# EAGLE design EC-TDS-PPM1_2 (EAGLE 7.5.0)
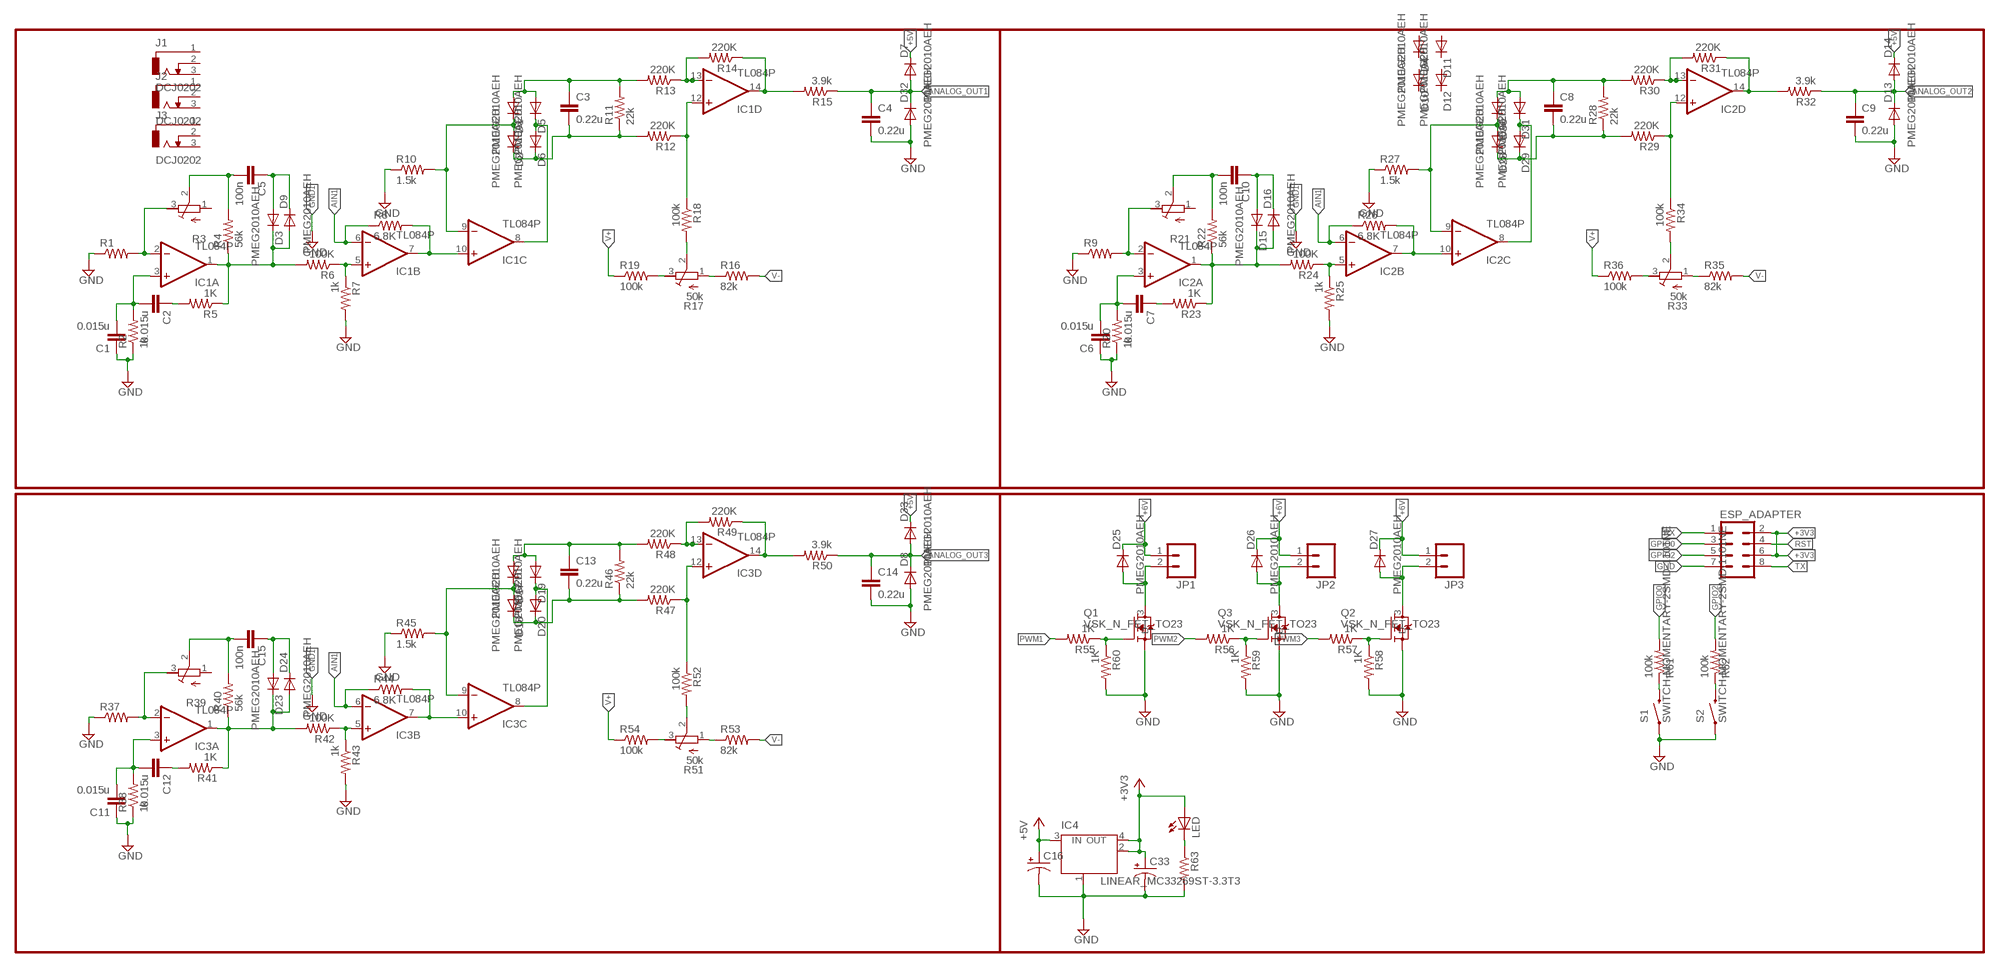
[diagram p0: schematic, sheet 1, part 1 of 2]
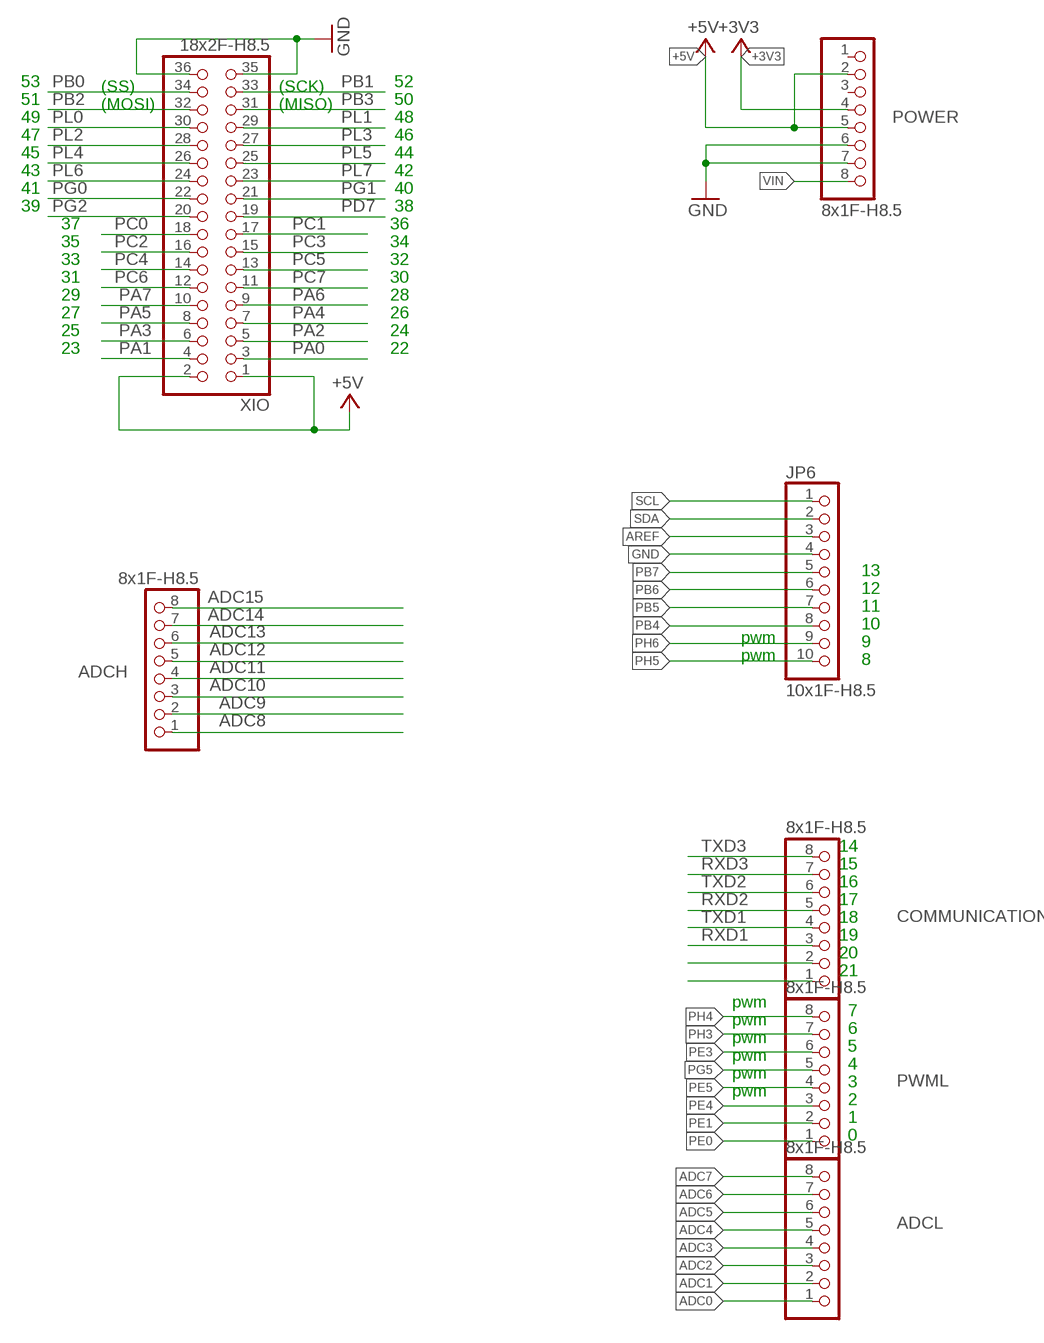
[diagram p1: schematic, sheet 1, part 2 of 2]

## Parts
ADCH  8x1F-H8.5  PINHD-1X8  [1X08]
ADCL  8x1F-H8.5  PINHD-1X8  [1X08]
C1  0.015u  C-EUC0603  [C0603]
C2  0.015u  C-EUC0603  [C0603]
C3  0.22u  C-EUC0603  [C0603]
C4  0.22u  C-EUC0603  [C0603]
C5  100n  C-EUC0603  [C0603]
C6  0.015u  C-EUC0603  [C0603]
C7  0.015u  C-EUC0603  [C0603]
C8  0.22u  C-EUC0603  [C0603]
C9  0.22u  C-EUC0603  [C0603]
C10  100n  C-EUC0603  [C0603]
C11  0.015u  C-EUC0603  [C0603]
C12  0.015u  C-EUC0603  [C0603]
C13  0.22u  C-EUC0603  [C0603]
C14  0.22u  C-EUC0603  [C0603]
C15  100n  C-EUC0603  [C0603]
C16  CPOL-USSMCC  [SMC_C]
C33  CPOL-USSMCC  [SMC_C]
COMMUNICATION  8x1F-H8.5  PINHD-1X8  [1X08]
D1  PMEG2010AEH  DIOD_SOT123F  [SOT123F]
D2  PMEG2010AEH  DIOD_SOT123F  [SOT123F]
D3  PMEG2010AEH  DIOD_SOT123F  [SOT123F]
D4  PMEG2010AEH  DIOD_SOT123F  [SOT123F]
D5  PMEG2010AEH  DIOD_SOT123F  [SOT123F]
D6  PMEG2010AEH  DIOD_SOT123F  [SOT123F]
D7  PMEG2010AEH  DIOD_SOT123F  [SOT123F]
D8  PMEG2010AEH  DIOD_SOT123F  [SOT123F]
D9  PMEG2010AEH  DIOD_SOT123F  [SOT123F]
D10  PMEG2010AEH  DIOD_SOT123F  [SOT123F]
D11  PMEG2010AEH  DIOD_SOT123F  [SOT123F]
D12  PMEG2010AEH  DIOD_SOT123F  [SOT123F]
D13  PMEG2010AEH  DIOD_SOT123F  [SOT123F]
D14  PMEG2010AEH  DIOD_SOT123F  [SOT123F]
D15  PMEG2010AEH  DIOD_SOT123F  [SOT123F]
D16  PMEG2010AEH  DIOD_SOT123F  [SOT123F]
D17  PMEG2010AEH  DIOD_SOT123F  [SOT123F]
D18  PMEG2010AEH  DIOD_SOT123F  [SOT123F]
D19  PMEG2010AEH  DIOD_SOT123F  [SOT123F]
D20  PMEG2010AEH  DIOD_SOT123F  [SOT123F]
D23  PMEG2010AEH  DIOD_SOT123F  [SOT123F]
D24  PMEG2010AEH  DIOD_SOT123F  [SOT123F]
D25  PMEG2010AEH  DIOD_SOT123F  [SOT123F]
D26  PMEG2010AEH  DIOD_SOT123F  [SOT123F]
D27  PMEG2010AEH  DIOD_SOT123F  [SOT123F]
D28  PMEG2010AEH  DIOD_SOT123F  [SOT123F]
D29  PMEG2010AEH  DIOD_SOT123F  [SOT123F]
D30  PMEG2010AEH  DIOD_SOT123F  [SOT123F]
D31  PMEG2010AEH  DIOD_SOT123F  [SOT123F]
D32  PMEG2010AEH  DIOD_SOT123F  [SOT123F]
D33  PMEG2010AEH  DIOD_SOT123F  [SOT123F]
ESP_ADAPTER  M04X2  [2X4]
IC1  TL084P  [DIL14]
IC2  TL084P  [DIL14]
IC3  TL084P  [DIL14]
IC4  LINEAR_MC33269ST-3.3T3  [LINEAR_SOT223]
J1  DCJ0202  [DCJ0202]
J2  DCJ0202  [DCJ0202]
J3  DCJ0202  [DCJ0202]
JP1  M02PTH  [1X02]
JP2  M02PTH  [1X02]
JP3  M02PTH  [1X02]
JP6  10x1F-H8.5  PINHD-1X10_ARD  [1X10]
LED  SPARKFUN_LED0603  [SPARKFUN_LED-0603]
POWER  8x1F-H8.5  PINHD-1X8  [1X08]
PWML  8x1F-H8.5  PINHD-1X8  [1X08]
Q1  VSK_N_FET_TO23  [SOT23]
Q2  VSK_N_FET_TO23  [SOT23]
Q3  VSK_N_FET_TO23  [SOT23]
R1  R-US_R0603  [R0603]
R2  1k  R-US_R0603  [R0603]
R3  R-TRIMM64W  [RTRIM64W]
R4  56k  R-US_R0603  [R0603]
R5  1K  R-US_R0603  [R0603]
R6  100K  R-US_R0603  [R0603]
R7  1k  R-US_R0603  [R0603]
R8  6.8K  R-US_R0603  [R0603]
R9  R-US_R0603  [R0603]
R10  1.5k  R-US_R0603  [R0603]
R11  22k  R-US_R0603  [R0603]
R12  220K  R-US_R0603  [R0603]
R13  220K  R-US_R0603  [R0603]
R14  220K  R-US_R0603  [R0603]
R15  3.9k  R-US_R0603  [R0603]
R16  82k  R-US_R0603  [R0603]
R17  50k  R-TRIMM64W  [RTRIM64W]
R18  100k  R-US_R0603  [R0603]
R19  100k  R-US_R0603  [R0603]
R20  1k  R-US_R0603  [R0603]
R21  R-TRIMM64W  [RTRIM64W]
R22  56k  R-US_R0603  [R0603]
R23  1K  R-US_R0603  [R0603]
R24  100K  R-US_R0603  [R0603]
R25  1k  R-US_R0603  [R0603]
R26  6.8K  R-US_R0603  [R0603]
R27  1.5k  R-US_R0603  [R0603]
R28  22k  R-US_R0603  [R0603]
R29  220K  R-US_R0603  [R0603]
R30  220K  R-US_R0603  [R0603]
R31  220K  R-US_R0603  [R0603]
R32  3.9k  R-US_R0603  [R0603]
R33  50k  R-TRIMM64W  [RTRIM64W]
R34  100k  R-US_R0603  [R0603]
R35  82k  R-US_R0603  [R0603]
R36  100k  R-US_R0603  [R0603]
R37  R-US_R0603  [R0603]
R38  1k  R-US_R0603  [R0603]
R39  R-TRIMM64W  [RTRIM64W]
R40  56k  R-US_R0603  [R0603]
R41  1K  R-US_R0603  [R0603]
R42  100K  R-US_R0603  [R0603]
R43  1k  R-US_R0603  [R0603]
R44  6.8K  R-US_R0603  [R0603]
R45  1.5k  R-US_R0603  [R0603]
R46  22k  R-US_R0603  [R0603]
R47  220K  R-US_R0603  [R0603]
R48  220K  R-US_R0603  [R0603]
R49  220K  R-US_R0603  [R0603]
R50  3.9k  R-US_R0603  [R0603]
R51  50k  R-TRIMM64W  [RTRIM64W]
R52  100k  R-US_R0603  [R0603]
R53  82k  R-US_R0603  [R0603]
R54  100k  R-US_R0603  [R0603]
R55  1K  R-US_R0603  [R0603]
R56  1K  R-US_R0603  [R0603]
R57  1K  R-US_R0603  [R0603]
R58  1K  R-US_R0603  [R0603]
R59  1K  R-US_R0603  [R0603]
R60  1K  R-US_R0603  [R0603]
R61  100k  R-US_R0603  [R0603]
R62  100k  R-US_R0603  [R0603]
R63  SPARKFUN_RESISTOR0603-RES  [SPARKFUN_0603-RES]
S1  SWITCH-MOMENTARY-2SMD-1101NE  [TACTILE-SWITCH-1101NE]
S2  SWITCH-MOMENTARY-2SMD-1101NE  [TACTILE-SWITCH-1101NE]
XIO  18x2F-H8.5  PINHD-2X18  [2X18]

## Nets
+3V3: C33.+ ESP_ADAPTER.2 ESP_ADAPTER.6 IC4.2(OUT) IC4.4(OUT) LED.A POWER.4
+5V: C16.+ D7.C D14.C D33.C IC4.3(IN) POWER.2 POWER.5 XIO.1 XIO.2
+6V: D25.C D26.C D27.C JP1.1 JP2.1 JP3.1
ADC0: ADCL.1
ADC1: ADCL.2
ADC2: ADCL.3
ADC3: ADCL.4
ADC4: ADCL.5
ADC5: ADCL.6
ADC6: ADCL.7
ADC7: ADCL.8
ADC8: ADCH.1
ADC9: ADCH.2
ADC10: ADCH.3
ADC11: ADCH.4
ADC12: ADCH.5
ADC13: ADCH.6
ADC14: ADCH.7
ADC15: ADCH.8
AIN1: IC1.6(B:-IN) IC2.6(B:-IN) IC3.6(B:-IN) R8.1 R26.1 R44.1
ANALOG_OUT1: C4.1 D7.A D32.C R15.1
ANALOG_OUT2: C9.1 D13.C D14.A R32.1
ANALOG_OUT3: C14.1 D8.C D33.A R50.1
AREF: JP6.3
GND: ESP_ADAPTER.7 JP6.4 POWER.6 POWER.7 XIO.35 XIO.36
GND1: C1.1 C4.2 C6.1 C9.2 C11.1 C14.2 C16.- C33.- D8.A D13.A D32.A IC4.1(GND/ADJ) Q1.2(S) Q2.2(S) Q3.2(S) R1.1 R2.1 R7.2 R9.1 R10.1 R20.1 R25.2 R27.1 R37.1 R38.1 R43.2 R45.1 R58.2 R59.2 R60.2 R63.2 S1.1 S2.1 ; supply symbol labelled GND
GPIO0: ESP_ADAPTER.3 R61.2
GPIO2: ESP_ADAPTER.5 R62.2
N$1: IC1.2(A:-IN) R1.2 R3.3(E)
N$2: C2.1 R5.2
N$3: C1.2 C2.2 IC1.3(A:+IN) R2.2
N$4: IC1.5(B:+IN) R6.1 R7.1
N$5: C5.2 R3.2(S) R4.2
N$6: R16.1 R17.1(A)
N$7: D3.C D9.A IC1.1(A:OUT) R4.1 R5.1 R6.2
N$8: C5.1 D3.A D9.C
N$9: IC1.7(B:OUT) IC1.10(C:+IN) R8.2
N$10: R17.3(E) R19.2
N$11: IC1.13(D:-IN) R13.1 R14.2
N$12: C3.1 D1.A D5.A R11.2 R13.2
N$13: D1.C D2.A IC1.9(C:-IN) R10.2
N$14: C3.2 D2.C D6.C R11.1 R12.2
N$15: D5.C D6.A IC1.8(C:OUT)
N$16: IC1.12(D:+IN) R12.1 R18.1
N$17: IC1.14(D:OUT) R14.1 R15.2
N$18: R17.2(S) R18.2
N$19: IC2.2(A:-IN) R9.2 R21.3(E)
N$20: C6.2 C7.2 IC2.3(A:+IN) R20.2
N$21: C10.2 R21.2(S) R22.2
N$22: D15.C D16.A IC2.1(A:OUT) R22.1 R23.1 R24.2
N$23: C7.1 R23.2
N$24: IC2.5(B:+IN) R24.1 R25.1
N$25: IC2.7(B:OUT) IC2.10(C:+IN) R26.2
N$26: C8.1 D30.A D31.A R28.2 R30.2
N$27: D28.A D30.C IC2.9(C:-IN) R27.2
N$28: C8.2 D28.C D29.C R28.1 R29.2
N$29: D29.A D31.C IC2.8(C:OUT)
N$30: IC2.13(D:-IN) R30.1 R31.2
N$31: IC2.12(D:+IN) R29.1 R34.1
N$32: IC2.14(D:OUT) R31.1 R32.2
N$33: C10.1 D15.A D16.C
N$34: R33.1(A) R35.1
N$35: R33.3(E) R36.2
N$36: R33.2(S) R34.2
N$37: IC3.2(A:-IN) R37.2 R39.3(E)
N$38: C11.2 C12.2 IC3.3(A:+IN) R38.2
N$39: C15.2 R39.2(S) R40.2
N$40: D23.C D24.A IC3.1(A:OUT) R40.1 R41.1 R42.2
N$41: C12.1 R41.2
N$42: IC3.5(B:+IN) R42.1 R43.1
N$43: IC3.7(B:OUT) IC3.10(C:+IN) R44.2
N$44: C13.1 D17.A D19.A R46.2 R48.2
N$45: D17.C D18.A IC3.9(C:-IN) R45.2
N$46: C13.2 D18.C D20.C R46.1 R47.2
N$47: D19.C D20.A IC3.8(C:OUT)
N$48: IC3.13(D:-IN) R48.1 R49.2
N$49: IC3.12(D:+IN) R47.1 R52.1
N$50: IC3.14(D:OUT) R49.1 R50.2
N$51: C15.1 D23.A D24.C
N$52: R51.1(A) R53.1
N$53: R51.3(E) R54.2
N$54: R51.2(S) R52.2
N$55: D26.A JP2.2 Q3.3(D)
N$56: D27.A JP3.2 Q2.3(D)
N$57: D25.A JP1.2 Q1.3(D)
N$58: Q2.1(G) R57.1 R58.1
N$59: Q3.1(G) R56.1 R59.1
N$61: Q1.1(G) R55.1 R60.1
N$62: R61.1 S1.2
N$63: R62.1 S2.2
N$64: LED.C R63.1
PA0: XIO.3
PA1: XIO.4
PA2: XIO.5
PA3: XIO.6
PA4: XIO.7
PA5: XIO.8
PA6: XIO.9
PA7: XIO.10
PB0: XIO.34
PB1: XIO.33
PB2: XIO.32
PB3: XIO.31
PB4: JP6.8
PB5: JP6.7
PB6: JP6.6
PB7: JP6.5
PC0: XIO.18
PC1: XIO.17
PC2: XIO.16
PC3: XIO.15
PC4: XIO.14
PC5: XIO.13
PC6: XIO.12
PC7: XIO.11
PD7: XIO.19
PE0: PWML.1
PE1: PWML.2
PE3: PWML.6
PE4: PWML.3
PE5: PWML.4
PG0: XIO.22
PG1: XIO.21
PG2: XIO.20
PG5: PWML.5
PH3: PWML.7
PH4: PWML.8
PH5: JP6.10
PH6: JP6.9
PL0: XIO.30
PL1: XIO.29
PL2: XIO.28
PL3: XIO.27
PL4: XIO.26
PL5: XIO.25
PL6: XIO.24
PL7: XIO.23
PWM1: R55.2
PWM2: R56.2
PWM3: R57.2
RST: ESP_ADAPTER.4
RX: ESP_ADAPTER.1
RXD1: COMMUNICATION.3
RXD2: COMMUNICATION.5
RXD3: COMMUNICATION.7
SCL: COMMUNICATION.1 JP6.1
SDA: COMMUNICATION.2 JP6.2
TX: ESP_ADAPTER.8
TXD1: COMMUNICATION.4
TXD2: COMMUNICATION.6
TXD3: COMMUNICATION.8
V+: R19.1 R36.1 R54.1
V-: R16.2 R35.2 R53.2
VIN [power]: POWER.8
Unconnected: D4.A D4.C D10.A D10.C D11.A D11.C D12.A D12.C J1.1 J1.2 J1.3 J2.1 J2.2 J2.3 J3.1 J3.2 J3.3 POWER.1 POWER.3 R3.1(A) R21.1(A) R39.1(A)

## Notes on the sheet
- 53 | (SS) | (SCK) | 52
- 51 | (MOSI) | (MISO) | 50
- 49 | 48
- 47 | 46
- 45 | 44
- 43 | 42
- 41 | 40
- 39 | 38
- 37 | 36
- 35 | 34
- 33 | 32
- 31 | 30
- 29 | 28
- 27 | 26
- 25 | 24
- 23 | 22
- 13
- 12
- 11
- 10
- pwm | 9
- pwm | 8
- 14
- 15
- 16
- 17
- 18
- 19
- 20
- 21
- pwm
- 7
- pwm
- 6
- pwm
- 5
- pwm
- 4
- pwm
- 3
- pwm
- 2
- 1
- 0

## Power pins joined to a net without a drawn wire
V+: IC1.4(P:V+) IC2.4(P:V+) IC3.4(P:V+)
V-: IC1.11(P:V-) IC2.11(P:V-) IC3.11(P:V-)

## Library data of the parts
ADCH ADCL COMMUNICATION POWER PWML = SmartPrj:PINHD-1X8: PIN HEADER
C1-C15 = resistor:C-EU: CAPACITOR, European symbol
C16 C33 = rcl:CPOL-US: POLARIZED CAPACITOR, American symbol
D1-D20 D23-D33 = Enleka_Diode:DIOD_SOT123F; PARTNO: PMEG2010AEH,115
ESP_ADAPTER = SparkFun-Connectors:M04X2: .1" header, two rows of four.
IC1-IC3 = linear:TL084: OP AMP
IC4 = Robotech_Other:LINEAR_MC33269ST*: Adjustable Output Low Dropout Voltage Regulator 800 mA Source: http://www.onsemi.com/pub/Collateral/MC33269-D.PDF
J1-J3 = con-jack:DCJ0202: DC POWER JACK Source: DCJ0202.pdf; OC_FARNELL: unknown; OC_NEWARK: unknown
JP1-JP3 = SparkFun-Connectors:M02: Standard 2-pin 0.1" header. Use with - straight break away headers ( PRT-00116) - right angle break away headers (PRT-00553) - swiss pins (PRT-00743) - machine pins (PRT-00117) - female headers (PRT-00115) Molex polarized connector foot print use with: PRT-08233 with associated crimp pins and housings. 2.54_SCREWTERM for use with PRT-10571. 3.5mm Screw Terminal footprints for PRT-08084 5mm Screw Terminal footprints for use with PRT-08432
JP6 = SmartPrj:PINHD-1X10_ARD: PIN HEADER
LED = Robotech RLC of Chung:SPARKFUN_LED: LEDs Standard schematic elements and footprints for 5mm, 3mm, 1206, and 0603 sized LEDs. 5mm - Spark Fun Electronics SKU : COM-00529 (and others)
Q1-Q3 = transistor-fet:VSK_N_FET_TO23
R1 R2 R4-R16 R18-R20 R22-R32 R34-R38 R40-R50 R52-R62 = resistor:R-US_: RESISTOR, American symbol
R3 R17 R21 R33 R39 R51 = resistor:R-TRIMM: Trimm resistor
R63 = Robotech_RCL:SPARKFUN_RESISTOR: Resistor Basic schematic elements and footprints for 0603, 1206, and PTH resistors.
S1 S2 = SparkFun-Electromechanical:SWITCH-MOMENTARY-2: Various NO switches- pushbuttons, reed, etc; PROD_ID: SWCH-00815
XIO = SmartPrj:PINHD-2X18: PIN HEADER

## Net classes
0 default: width 0.203 mm, drill 0.406 mm, clearance 0.203 mm
1 power: width 0.61 mm, drill 0.406 mm, clearance 0.203 mm
2 gnd: width 0.305 mm, drill 0.406 mm, clearance 0.203 mm
3 power usb: width 0.508 mm, drill 0.406 mm, clearance 0.203 mm

## Board
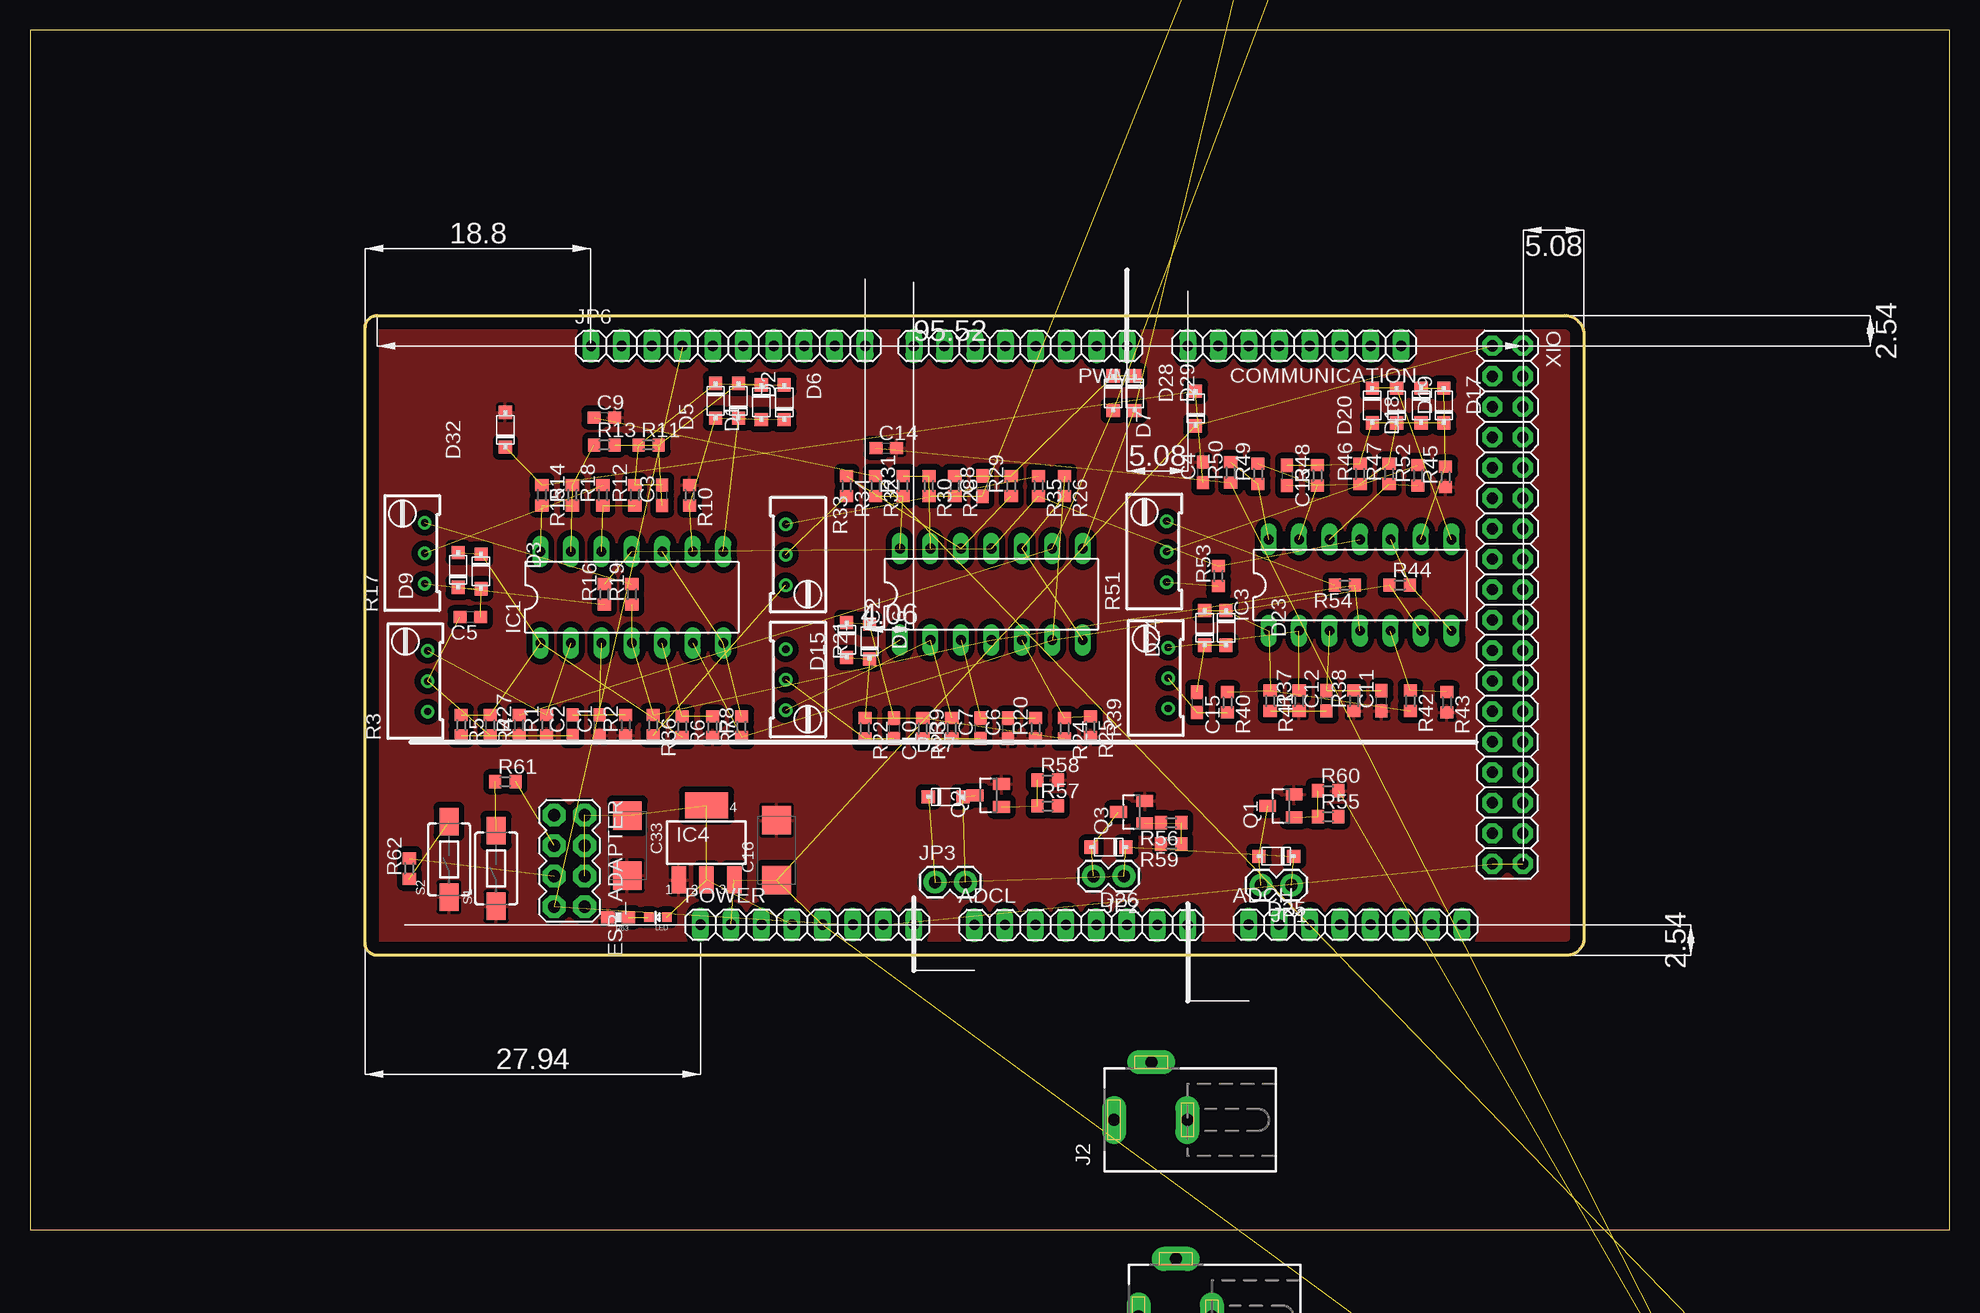
[diagram p2: board, top side]
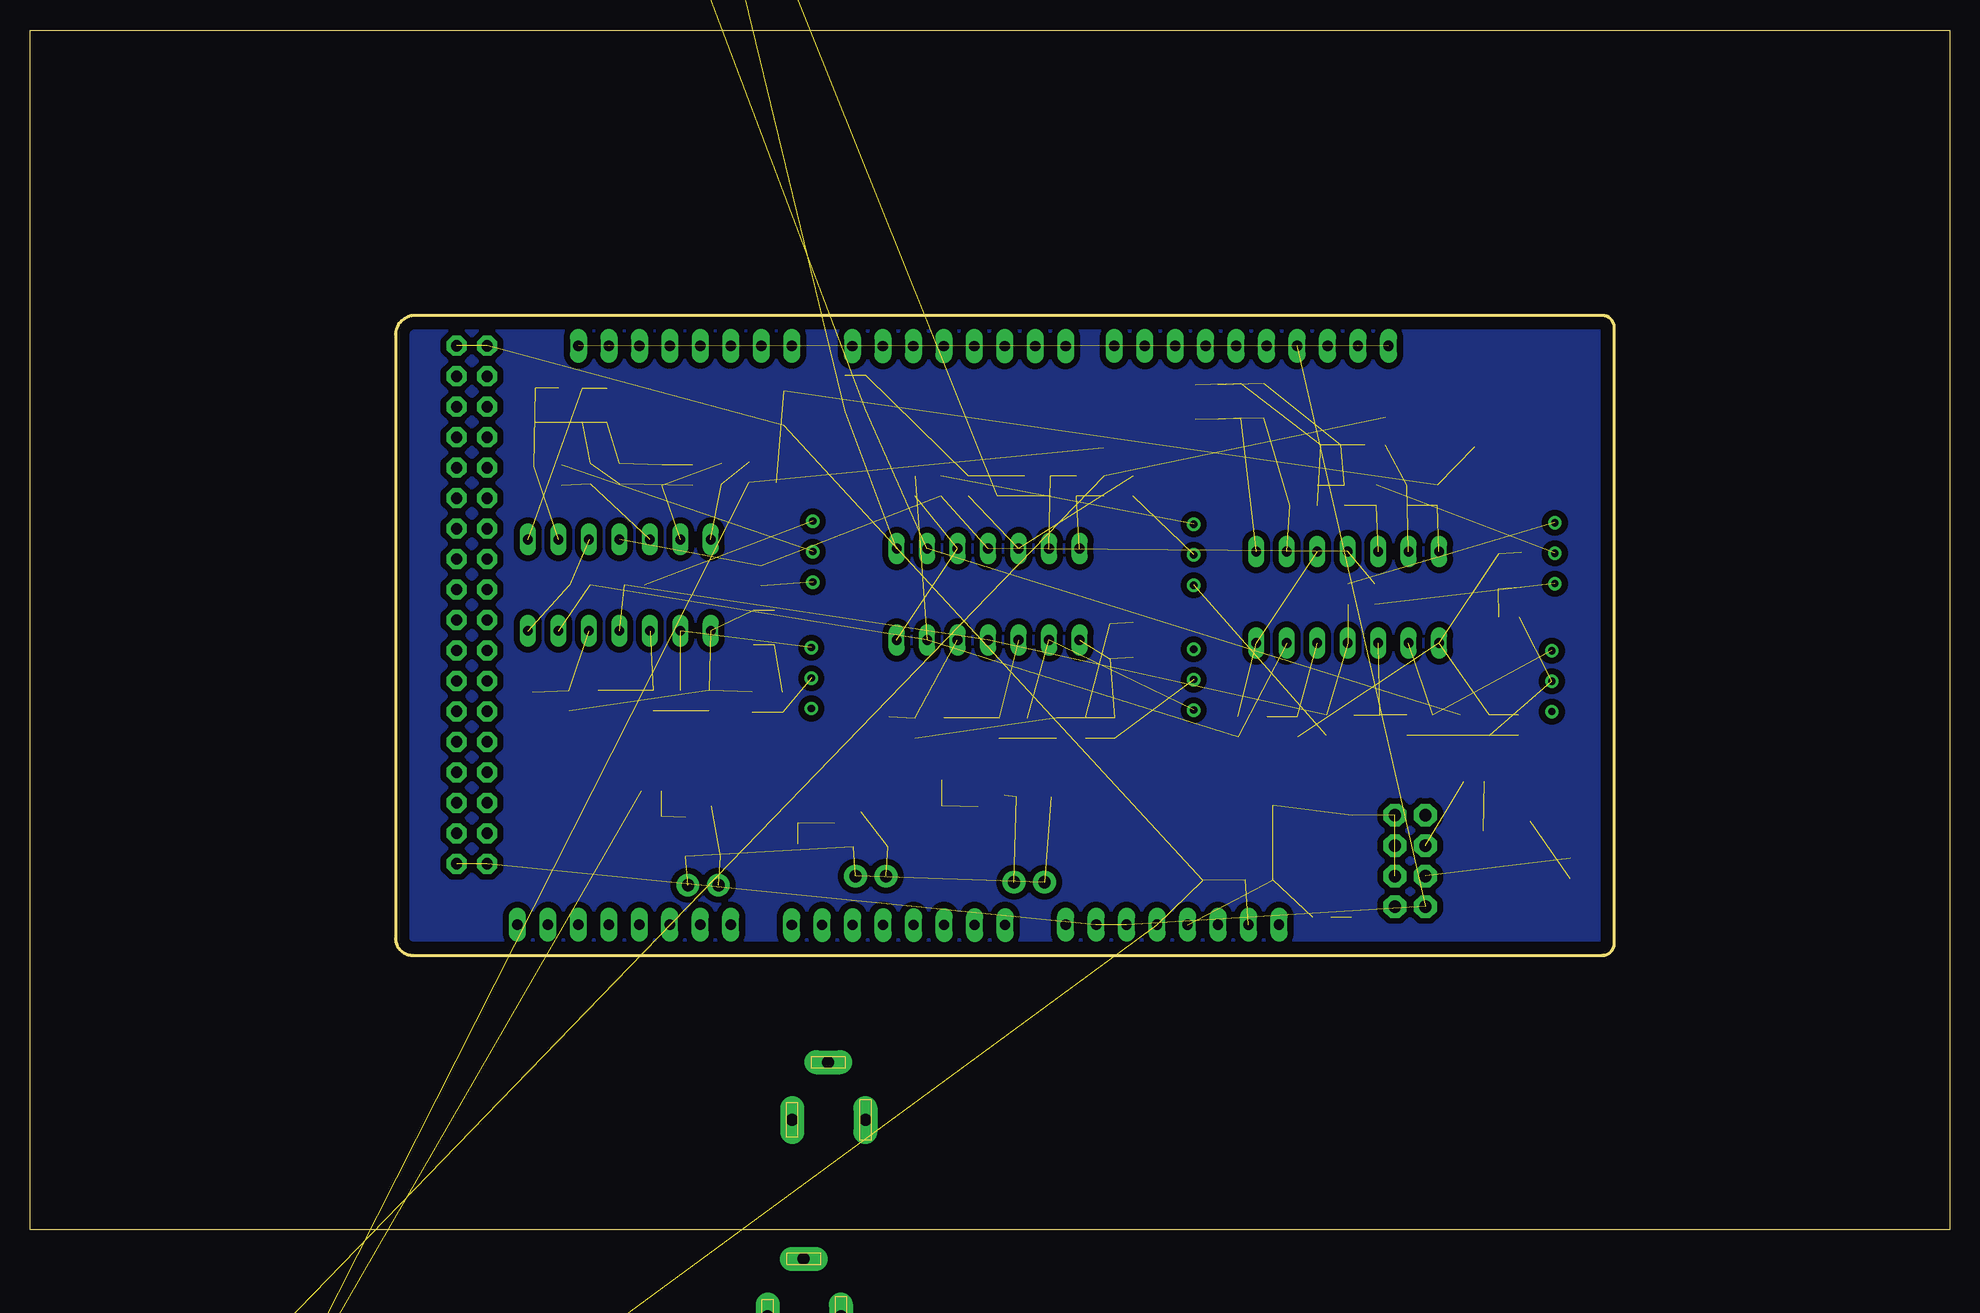
[diagram p3: board, bottom side, seen from below]

Size 160 x 100 mm. Coordinates in mm from the lower left corner, seen from the top.
Outline: 0,0 160,0 160,100 0,100 0,0
Outline: 28.94,76.19 127.92,76.19 arc-90 129.54,74.57 129.54,24.3 arc-90 128.1,22.86 28.94,22.86 arc-90 27.94,23.86 27.94,75.19 arc-90 28.94,76.19
Copper layers (1*16): Top 0.035mm / dielectric 1.5mm / Bottom 0.035mm
Design rules "default": minimum track width 10mil, minimum drill 24mil, track to track 8mil, track to pad 8mil, pad to pad 8mil, via to via 8mil, smd to smd 8mil, copper to edge 40mil, drill to drill 8mil, minimum pad ring 10mil, minimum via ring 8mil, stop-mask expansion 4mil, vias tented up to drill 0mil, thermal gap 10mil

### Footprints (pad centres in the part's own frame; a part is rotated, then mirrored left to right if it is on the bottom)
1X08 = drill 0.85 pad 1.422 long: 1 -8.89,0; 2 -6.35,0; 3 -3.81,0; 4 -1.27,0; 5 1.27,0; 6 3.81,0; 7 6.35,0; 8 8.89,0
C0603 = smd 1.1 x 1: 1 -0.85,0; 2 0.85,0
SMC_C = smd 2.4 x 2.4: + -2.5,0; - 2.5,0
SOT123F = smd 1.1 x 1.1: A 1.45,0; C -1.45,0
2X4 = drill 1.016 pad 1.88 octagon: 1 -3.81,-1.27; 2 -3.81,1.27; 3 -1.27,-1.27; 4 -1.27,1.27; 5 1.27,-1.27; 6 1.27,1.27; 7 3.81,-1.27; 8 3.81,1.27
DIL14 = drill 0.813 long: 1 -7.62,-3.81; 2 -5.08,-3.81; 3 -2.54,-3.81; 4 0,-3.81; 5 2.54,-3.81; 6 5.08,-3.81; 7 7.62,-3.81; 8 7.62,3.81; 9 5.08,3.81; 10 2.54,3.81; 11 0,3.81; 12 -2.54,3.81; 13 -5.08,3.81; 14 -7.62,3.81
LINEAR_SOT223 = smd 1.219 x 2.235: 1 -2.311,-3.099; 2 0,-3.099; 3 2.311,-3.099 | smd 3.6 x 2.2: 4 0,3.099
DCJ0202 = drill 1 pad 2 long: 1 0,3.1; 2 4.8,0; 3 0,-3
1X02 = drill 1.016 pad 1.88: 1 0,0; 2 2.54,0
1X10 = drill 0.85 pad 1.422 long: 1 -11.43,0; 2 -8.89,0; 3 -6.35,0; 4 -3.81,0; 5 -1.27,0; 6 1.27,0; 7 3.81,0; 8 6.35,0; 9 8.89,0; 10 11.43,0
SPARKFUN_LED-0603 = smd 0.8 x 0.8: A 0,-0.75; C 0,0.75
SOT23 = smd 1 x 1.4: 1 -0.95,-1.1; 2 0.95,-1.1; 3 0,1.1
R0603 = smd 1 x 1.1: 1 -0.85,0; 2 0.85,0
RTRIM64W = drill 0.61: 1 1.27,-2.54; 2 1.27,0; 3 1.27,2.54
SPARKFUN_0603-RES = smd 1.1 x 1: 1 -0.85,0; 2 0.85,0
TACTILE-SWITCH-1101NE = smd 2.3 x 1.6: 1 -3.15,0; 2 3.15,0
2X18 = drill 0.95 pad 1.676 octagon: 1 -21.59,-1.27; 2 -21.59,1.27; 3 -19.05,-1.27; 4 -19.05,1.27; 5 -16.51,-1.27; 6 -16.51,1.27; 7 -13.97,-1.27; 8 -13.97,1.27; 9 -11.43,-1.27; 10 -11.43,1.27; 11 -8.89,-1.27; 12 -8.89,1.27; 13 -6.35,-1.27; 14 -6.35,1.27; 15 -3.81,-1.27; 16 -3.81,1.27; 17 -1.27,-1.27; 18 -1.27,1.27; 19 1.27,-1.27; 20 1.27,1.27; 21 3.81,-1.27; 22 3.81,1.27; 23 6.35,-1.27; 24 6.35,1.27; 25 8.89,-1.27; 26 8.89,1.27; 27 11.43,-1.27; 28 11.43,1.27; 29 13.97,-1.27; 30 13.97,1.27; 31 16.51,-1.27; 32 16.51,1.27; 33 19.05,-1.27; 34 19.05,1.27; 35 21.59,-1.27; 36 21.59,1.27

### Placement (x,y rotation side)
ADCH  110.48,25.41 0 top
ADCL  87.62,25.39 0 top
C1  47.5,42.04 90 top
C2  45.21,42.04 90 top
C3  52.7,61.21 90 top
C4  97.79,63.12 90 top
C5  36.7,51.05 180 top
C6  81.53,41.78 90 top
C7  79.25,41.78 90 top
C8  79.38,61.98 90 top
C9  47.88,67.69 0 top
C10  72.01,41.78 270 top
C11  112.65,44.07 90 top
C12  108.08,44.07 90 top
C13  104.78,62.87 270 top
C14  71.37,65.15 0 top
C15  97.28,43.94 270 top
C16  62.23,31.62 90 top
C33  49.78,32 270 top
COMMUNICATION  105.4,73.67 180 top
D1  62.87,68.96 90 top
D2  57.15,69.09 270 top
D3  37.59,54.86 270 top
D4  101.09,135.76 270 top  (outside the outline)
D5  59.05,69.09 90 top
D6  60.96,68.96 270 top
D7  97.16,68.45 90 top
D8  153.8,-42.42 90 top  (outside the outline)
D9  35.69,54.99 90 top
D10  93.47,135.76 270 top  (outside the outline)
D11  85.85,135.76 270 top  (outside the outline)
D12  78.23,135.76 270 top  (outside the outline)
D13  173.61,-42.42 90 top  (outside the outline)
D14  180.21,-42.42 90 top  (outside the outline)
D15  69.98,49.02 90 top
D16  68.07,49.15 270 top
D17  115.95,68.71 270 top
D18  117.86,68.71 90 top
D19  111.89,68.71 270 top
D20  113.92,68.71 90 top
D23  99.69,50.16 270 top
D24  97.92,50.16 90 top
D25  103.89,31.11 180 top
D26  89.92,31.88 180 top
D27  76.33,36.07 0 top
D28  90.3,69.72 270 top
D29  92.08,69.72 270 top
D30  116.33,135.76 270 top  (outside the outline)
D31  108.71,135.76 270 top  (outside the outline)
D32  39.62,66.67 90 top
D33  160.4,-42.42 90 top  (outside the outline)
ESP_ADAPTER  44.96,30.73 270 top
IC1  50.16,52.7 0 top
IC2  80.14,52.96 0 top
IC3  110.87,53.72 0 top
IC4  56.39,32.26 0 top
J1  95.5,-7.24 90 top
J2  93.47,9.14 90 top
J3  96.27,-21.34 90 top  (outside the outline)
JP1  105.16,28.7 180 top
JP2  91.19,29.46 180 top
JP3  75.44,28.96 0 top
JP6  58.19,73.66 0 top
LED  52.32,26.04 90 top
POWER  64.78,25.41 0 top
PWML  82.56,73.65 180 top
Q1  104.27,35.31 90 top
Q2  79.88,36.2 90 top
Q3  91.82,34.8 90 top
R1  43.05,42.04 90 top
R2  49.66,42.04 90 top
R3  31.88,45.72 0 top
R4  38.35,42.04 270 top
R5  35.94,42.04 270 top
R6  54.36,41.91 270 top
R7  56.9,41.91 270 top
R8  59.31,41.91 90 top
R9  76.83,41.78 90 top
R10  54.99,61.21 270 top
R11  51.56,65.41 0 top
R12  50.42,61.21 90 top
R13  47.88,65.41 0 top
R14  45.21,61.21 90 top
R15  42.67,61.21 270 top
R16  47.88,52.96 90 top
R17  31.62,56.39 0 top
R18  47.75,61.21 90 top
R19  50.16,52.96 90 top
R20  83.82,41.78 90 top
R21  64.26,45.85 180 top
R22  69.6,41.78 270 top
R23  74.42,41.78 270 top
R24  86.23,41.78 270 top
R25  88.39,41.91 270 top
R26  86.23,61.98 270 top
R27  40.77,42.04 90 top
R28  77.09,61.98 270 top
R29  81.79,61.98 90 top
R30  74.93,61.98 270 top
R31  72.77,61.98 90 top
R32  70.48,61.98 270 top
R33  64.26,56.26 180 top
R34  68.07,61.98 270 top
R35  84.07,61.98 270 top
R36  51.94,42.04 270 top
R37  105.79,44.07 90 top
R38  110.36,44.07 90 top
R39  93.6,45.97 0 top
R40  99.82,43.94 270 top
R41  103.38,44.07 270 top
R42  115.06,44.07 270 top
R43  118.11,43.94 270 top
R44  114.17,53.72 0 top
R45  117.98,62.74 90 top
R46  110.87,62.99 90 top
R47  113.28,62.99 90 top
R48  107.31,62.87 90 top
R49  102.36,62.99 90 top
R50  100.08,63.12 90 top
R51  93.47,56.52 0 top
R52  115.7,62.87 90 top
R53  99.06,54.48 90 top
R54  109.6,53.72 180 top
R55  108.2,34.42 0 top
R56  95.12,33.91 180 top
R57  84.84,35.31 0 top
R58  84.84,37.47 0 top
R59  95.12,32.13 180 top
R60  108.2,36.58 0 top
R61  39.62,37.34 0 top
R62  31.62,30.1 90 top
R63  49.02,26.04 180 top
S1  38.86,30.1 90 top
S2  34.92,30.86 90 top
XIO  123.16,52.08 270 top

### Tracks (layer width: path | path; a pad name or v marks a point on that pad's centre or on a via)
+3V3  (6 unrouted)
+5V  (8 unrouted)
+6V  (5 unrouted)
AIN1  (5 unrouted)
ANALOG_OUT1  (3 unrouted)
ANALOG_OUT2  (3 unrouted)
ANALOG_OUT3  (3 unrouted)
GND  (5 unrouted)
GND1  (2 unrouted)
  pour Bottom (isolate 0.508): 27.94,76.2 27.94,22.86 129.54,22.86 129.54,76.2
  pour Top (isolate 0.508): 27.94,76.2 27.94,22.86 129.54,22.86 129.54,76.2
GPIO0  (1 unrouted)
GPIO2  (1 unrouted)
N$1  (2 unrouted)
N$2  (1 unrouted)
N$3  (3 unrouted)
N$4  (2 unrouted)
N$5  (2 unrouted)
N$6  (1 unrouted)
N$7  (5 unrouted)
N$8  (2 unrouted)
N$9  (2 unrouted)
N$10  (1 unrouted)
N$11  (2 unrouted)
N$12  (4 unrouted)
N$13  (3 unrouted)
N$14  (4 unrouted)
N$15  (2 unrouted)
N$16  (2 unrouted)
N$17  (2 unrouted)
N$18  (1 unrouted)
N$19  (2 unrouted)
N$20  (3 unrouted)
N$21  (2 unrouted)
N$22  (5 unrouted)
N$23  (1 unrouted)
N$24  (2 unrouted)
N$25  (2 unrouted)
N$26  (4 unrouted)
N$27  (3 unrouted)
N$28  (4 unrouted)
N$29  (2 unrouted)
N$30  (2 unrouted)
N$31  (2 unrouted)
N$32  (2 unrouted)
N$33  (2 unrouted)
N$34  (1 unrouted)
N$35  (1 unrouted)
N$36  (1 unrouted)
N$37  (2 unrouted)
N$38  (3 unrouted)
N$39  (2 unrouted)
N$40  (5 unrouted)
N$41  (1 unrouted)
N$42  (2 unrouted)
N$43  (2 unrouted)
N$44  (4 unrouted)
N$45  (3 unrouted)
N$46  (4 unrouted)
N$47  (2 unrouted)
N$48  (2 unrouted)
N$49  (2 unrouted)
N$50  (2 unrouted)
N$51  (2 unrouted)
N$52  (1 unrouted)
N$53  (1 unrouted)
N$54  (1 unrouted)
N$55  (2 unrouted)
N$56  (2 unrouted)
N$57  (2 unrouted)
N$58  (2 unrouted)
N$59  (2 unrouted)
N$61  (2 unrouted)
N$62  (1 unrouted)
N$63  (1 unrouted)
N$64  (1 unrouted)
SCL  (1 unrouted)
SDA  (1 unrouted)
V+  (5 unrouted)
V-  (5 unrouted)